# Altium schematic sheet Charger.SchDoc
size A; SheetNumber: 2; SheetTotal: 3
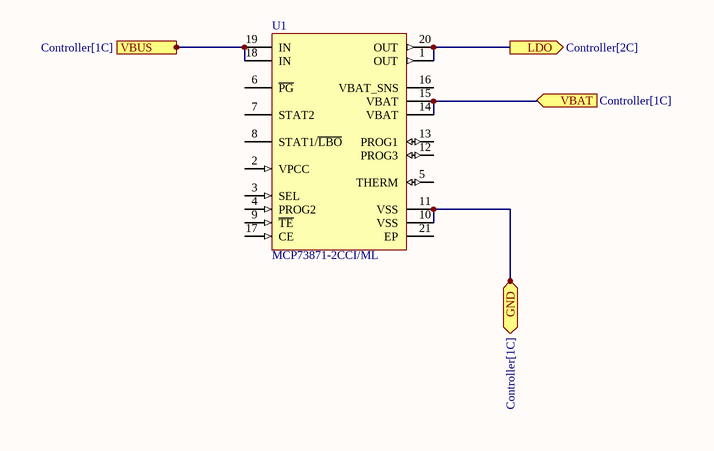
[diagram p0: Charger.SchDoc]

## Parts
U1  MCP73871-2CCI/ML  [QFN-ML20_M]

## Ports
GND (bidir, see Controller[1C]), LDO (out, see Controller[2C]), VBAT (in, see Controller[1C]), VBUS (in, see Controller[1C])

## Nets
GND: U1.10(VSS) U1.11(VSS) ; port GND
LDO: U1.1(OUT) U1.20(OUT) ; port LDO
VBAT: U1.14(VBAT) U1.15(VBAT) ; port VBAT
VBUS: U1.18(IN) U1.19(IN) ; port VBUS

Not connected (* = marked no-connect by the designer): U1 2(VPCC) 3(SEL) 4(PROG2) 5(THERM) 6(~{PG}) 7(STAT2) 8(STAT1/~{LBO}) 9(~{TE}) 12(PROG3) 13(PROG1) 16(VBAT_SNS) 17(CE) 21(EP)

## Library data of the parts
U1 = CMP-0133-00005-1: Stand-Alone System Load Sharing and Li-Ion/Li-Polymer Battery Charge Management Controller, 4.2V, 20-Pin QFN, Industrial Temperature; PackageDescription: 20-Lead Plastic Quad Flat, No Lead Package (ML) - 4x4x0.9 mm Body [QFN]; PackageReference: QFN-ML20; PackageVersion: revBB, Aug-2009; DatasheetVersion: revB, May-2009